# EAGLE schematic Buzz (EAGLE 7.2.0)
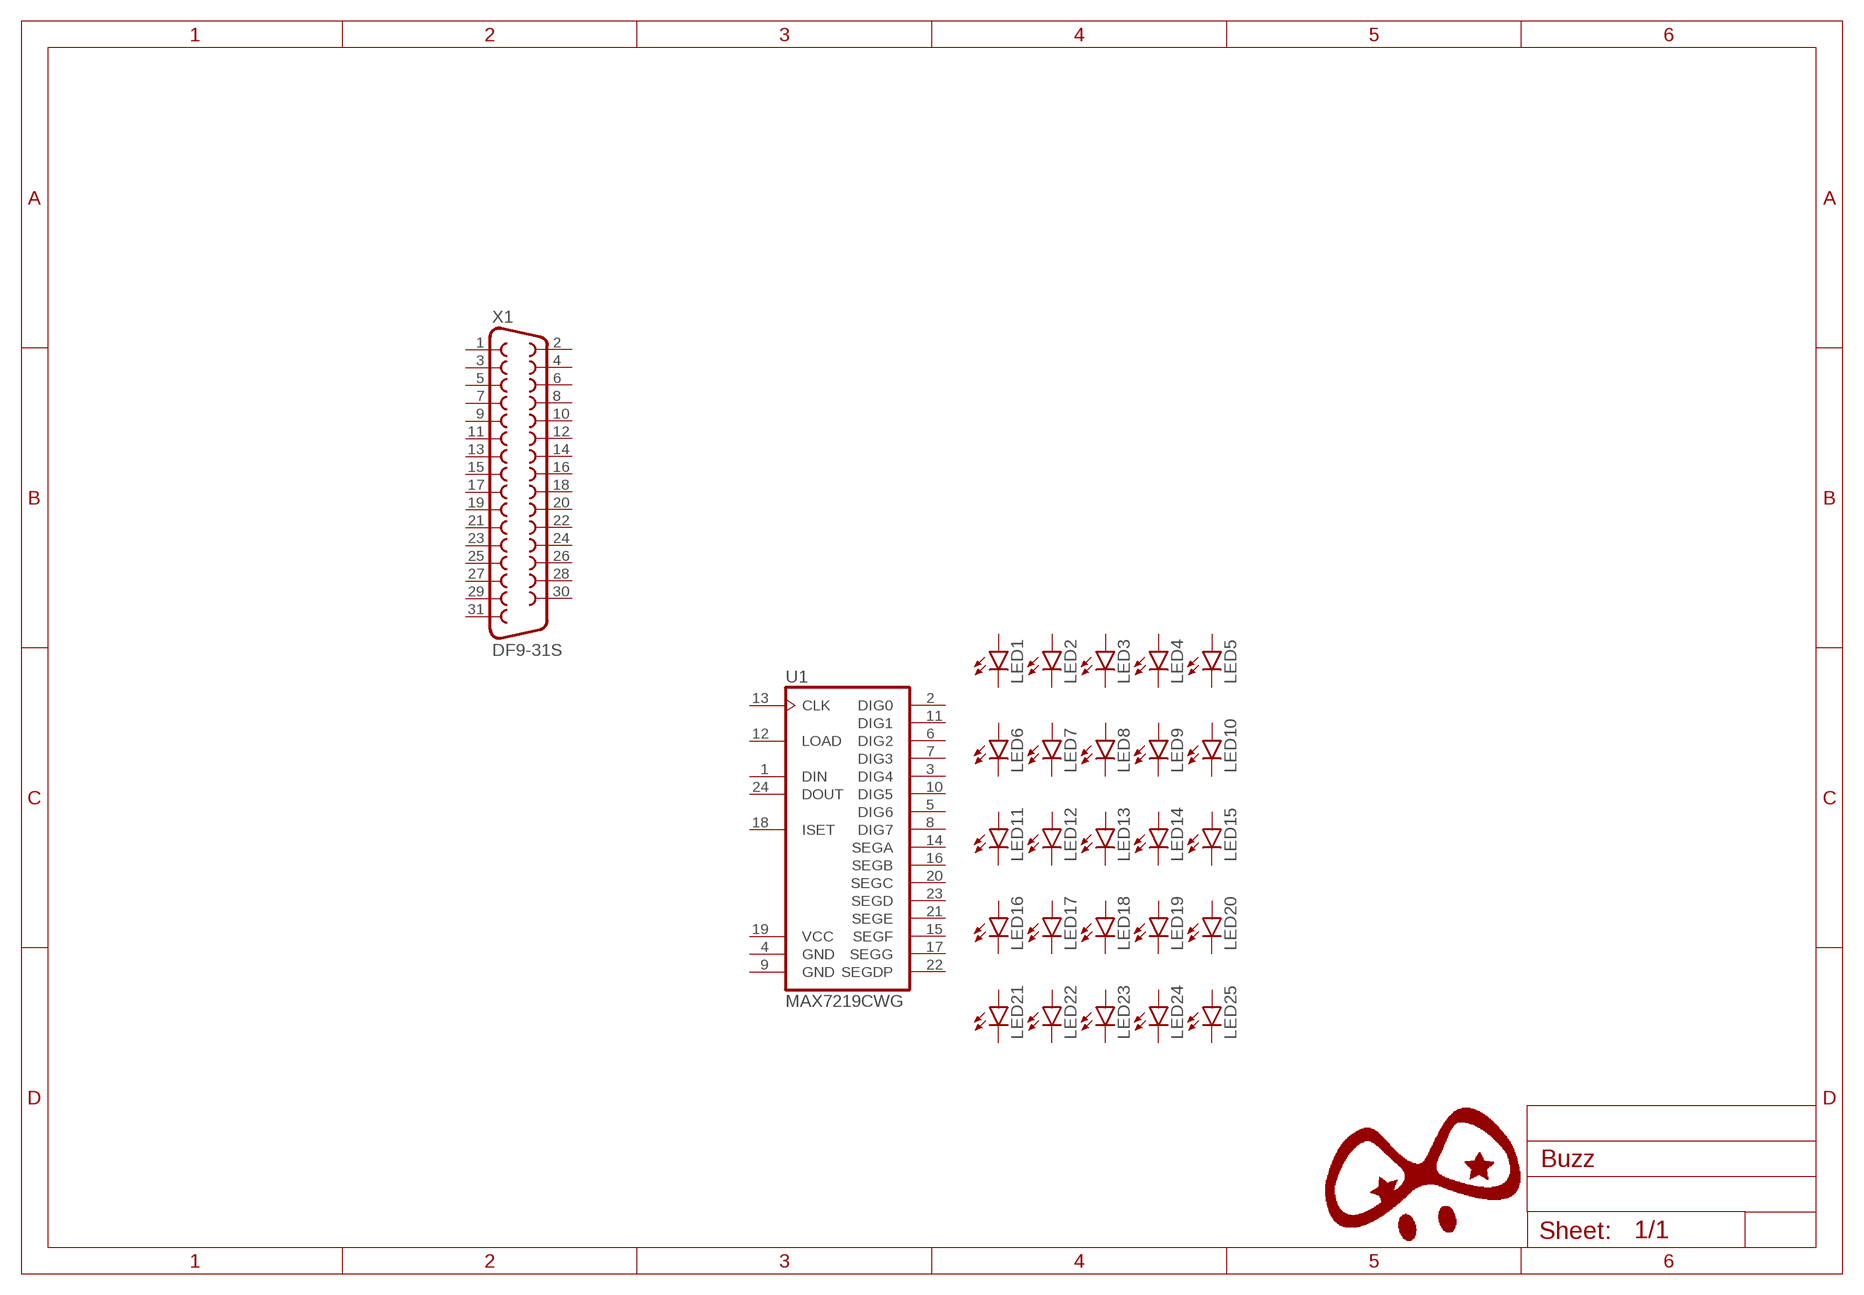
[diagram p0: schematic, sheet 1]

## Parts
LED1  LED0603  [LED-0603]
LED2  LED0603  [LED-0603]
LED3  LED0603  [LED-0603]
LED4  LED0603  [LED-0603]
LED5  LED0603  [LED-0603]
LED6  LED0603  [LED-0603]
LED7  LED0603  [LED-0603]
LED8  LED0603  [LED-0603]
LED9  LED0603  [LED-0603]
LED10  LED0603  [LED-0603]
LED11  LED0603  [LED-0603]
LED12  LED0603  [LED-0603]
LED13  LED0603  [LED-0603]
LED14  LED0603  [LED-0603]
LED15  LED0603  [LED-0603]
LED16  LED0603  [LED-0603]
LED17  LED0603  [LED-0603]
LED18  LED0603  [LED-0603]
LED19  LED0603  [LED-0603]
LED20  LED0603  [LED-0603]
LED21  LED0603  [LED-0603]
LED22  LED0603  [LED-0603]
LED23  LED0603  [LED-0603]
LED24  LED0603  [LED-0603]
LED25  LED0603  [LED-0603]
U1  MAX7219CWG  [SO24L]
X1  DF9-31S  [DF9-31S]
Unconnected: LED1.A LED1.C LED2.A LED2.C LED3.A LED3.C LED4.A LED4.C LED5.A LED5.C LED6.A LED6.C LED7.A LED7.C LED8.A LED8.C LED9.A LED9.C LED10.A LED10.C LED11.A LED11.C LED12.A LED12.C LED13.A LED13.C LED14.A LED14.C LED15.A LED15.C LED16.A LED16.C LED17.A LED17.C LED18.A LED18.C LED19.A LED19.C LED20.A LED20.C LED21.A LED21.C LED22.A LED22.C LED23.A LED23.C LED24.A LED24.C LED25.A LED25.C U1.1(DIN) U1.2(DIG0) U1.3(DIG4) U1.5(DIG6) U1.6(DIG2) U1.7(DIG3) U1.8(DIG7) U1.10(DIG5) U1.11(DIG1) U1.12(LOAD) U1.13(CLK) U1.14(SEGA) U1.15(SEGF) U1.16(SEGB) U1.17(SEGG) U1.18(ISET) U1.20(SEGC) U1.21(SEGE) U1.22(SEGDP) U1.23(SEGD) U1.24(DOUT) X1.1 X1.2 X1.3 X1.4 X1.5 X1.6 X1.7 X1.8 X1.9 X1.10 X1.11 X1.12 X1.13 X1.14 X1.15 X1.16 X1.17 X1.18 X1.19 X1.20 X1.21 X1.22 X1.23 X1.24 X1.25 X1.26 X1.27 X1.28 X1.29 X1.30 X1.31

## Power pins joined to a net without a drawn wire
GND: U1.4(GND) U1.9(GND)
VCC: U1.19(VCC)

## Library data of the parts
LED1-LED25 = SparkFun-LED:LED: LEDs Standard schematic elements and footprints for 5mm, 3mm, 1206, and 0603 sized LEDs. 5mm - Spark Fun Electronics SKU : COM-00529 (and others)
U1 = max7219:MAX7219CWG
X1 = con-hirose:DF9-31S: SMD CONNECTOR Source: con-hirose.lbr from Bob Starr <rtzaudio@mindspring.com>; MPN: DF9-31S-1V(32); OC_FARNELL: 1798382; OC_NEWARK: 74R3383